# Altium schematic sheet Processor.SchDoc
size A
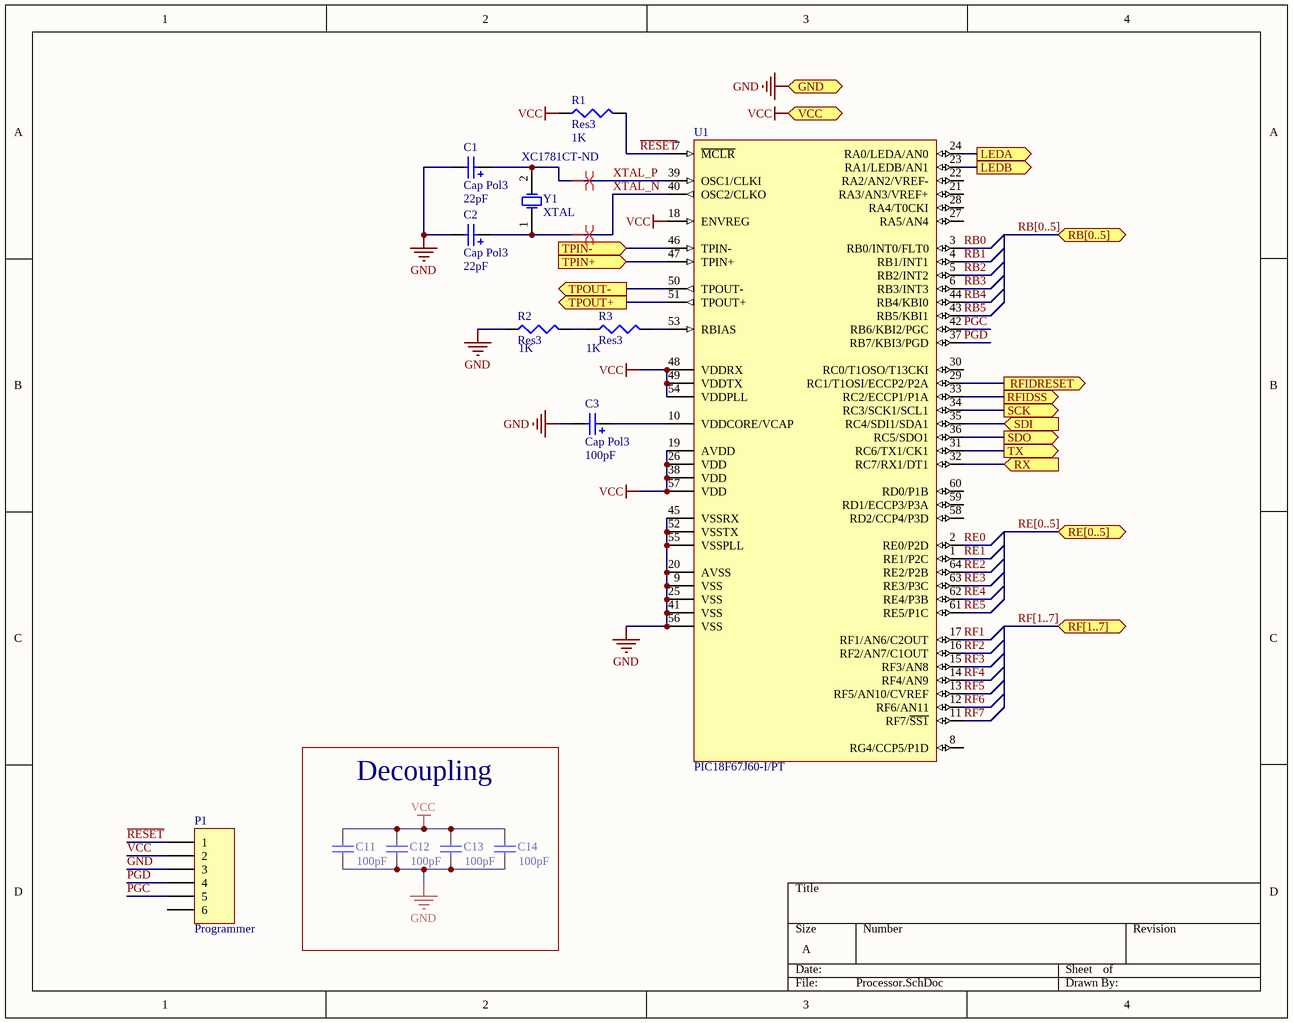
[diagram p0: Processor.SchDoc]

## Parts
C1  Cap Pol3  value 22pF  [C0805]
C2  Cap Pol3  value 22pF  [C0805]
C3  Cap Pol3  value 100pF  [C0805]
C11  value 100pF  [1608[0603]]  (hidden comment: Decoupling)
C12  value 100pF  [1608[0603]]  (hidden comment: Decoupling)
C13  value 100pF  [1608[0603]]  (hidden comment: Decoupling)
C14  value 100pF  [1608[0603]]  (hidden comment: Decoupling)
P1  Programmer  [HDR1X6]
R1  Res3  value 1K  [J1-0603]
R2  Res3  value 1K  [J1-0603]
R3  Res3  value 1K  [J1-0603]
U1  PIC18F67J60-I/PT  [TQFP-PT64_N]
Y1  XTAL  Supplier Part Number 1: XC1781CT-ND  [CSM-3X]

## Blocks framed on the sheet
Decoupling: C11-C14

## Ports
GND, LEDA (out), LEDB (out), RB[0..5] (bidir), RE[0..5] (bidir), RF[1..7] (bidir), RFIDRESET (out), RFIDSS (out), RX (in), SCK (out), SDI (in), SDO (out), TPIN+ (in), TPIN- (in), TPOUT+ (out), TPOUT- (out), TX (out), VCC

## Nets
GND: C1.2 C2.2 C3.2 C11.2 C12.2 C13.2 C14.2 P1.3 R2.1 U1.9(VSS) U1.20(AVSS) U1.25(VSS) U1.41(VSS) U1.45(VSSRX) U1.52(VSSTX) U1.55(VSSPLL) U1.56(VSS) ; port GND
VCC: C11.1 C12.1 C13.1 C14.1 P1.2 R1.1 U1.18(ENVREG) U1.19(AVDD) U1.26(VDD) U1.38(VDD) U1.48(VDDRX) U1.49(VDDTX) U1.54(VDDPLL) U1.57(VDD) ; port VCC
~{RESET}: P1.1 R1.2 U1.7(~{MCLR})
LEDA: U1.24(RA0/LEDA/AN0) ; port LEDA
LEDB: U1.23(RA1/LEDB/AN1) ; port LEDB
PGC: P1.5 U1.42(RB6/KBI2/PGC)
PGD: P1.4 U1.37(RB7/KBI3/PGD)
RB0: U1.3(RB0/INT0/FLT0)
RB1: U1.4(RB1/INT1)
RB2: U1.5(RB2/INT2)
RB3: U1.6(RB3/INT3)
RB4: U1.44(RB4/KBI0)
RB5: U1.43(RB5/KBI1)
RE0: U1.2(RE0/P2D)
RE1: U1.1(RE1/P2C)
RE2: U1.64(RE2/P2B)
RE3: U1.63(RE3/P3C)
RE4: U1.62(RE4/P3B)
RE5: U1.61(RE5/P1C)
RF1: U1.17(RF1/AN6/C2OUT)
RF2: U1.16(RF2/AN7/C1OUT)
RF3: U1.15(RF3/AN8)
RF4: U1.14(RF4/AN9)
RF5: U1.13(RF5/AN10/CVREF)
RF6: U1.12(RF6/AN11)
RF7: U1.11(RF7/~{SS1})
RFIDRESET: U1.29(RC1/T1OSI/ECCP2/P2A) ; port RFIDRESET
RFIDSS: U1.33(RC2/ECCP1/P1A) ; port RFIDSS
RX: U1.32(RC7/RX1/DT1) ; port RX
SCK: U1.34(RC3/SCK1/SCL1) ; port SCK
SDI: U1.35(RC4/SDI1/SDA1) ; port SDI
SDO: U1.36(RC5/SDO1) ; port SDO
TPIN+: U1.47(TPIN+) ; port TPIN+
TPIN-: U1.46(TPIN-) ; port TPIN-
TPOUT+: U1.51(TPOUT+) ; port TPOUT+
TPOUT-: U1.50(TPOUT-) ; port TPOUT-
TX: U1.31(RC6/TX1/CK1) ; port TX
XTAL_N: C2.1 U1.40(OSC2/CLKO) Y1.1(OSC1)
XTAL_P: C1.1 U1.39(OSC1/CLKI) Y1.2(OSC2)
NetC3_1: C3.1 U1.10(VDDCORE/VCAP)
NetR2_2: R2.2 R3.1
NetR3_2: R3.2 U1.53(RBIAS)

Not connected (* = marked no-connect by the designer): P1 6; U1 8(RG4/CCP5/P1D) 21(RA3/AN3/VREF+) 22(RA2/AN2/VREF-) 27(RA5/AN4) 28(RA4/T0CKI) 30(RC0/T1OSO/T13CKI) 58(RD2/CCP4/P3D) 59(RD1/ECCP3/P3A) 60(RD0/P1B)

## Buses and harness runs
bus RB[0..5] = port RB[0..5]
bus RE[0..5] = port RE[0..5]
bus RF[1..7] = port RF[1..7]

## Layout directives
differential pair: XTAL_N, XTAL_P

## Library data of the parts
C1-C3 = Cap Pol3: Polarized Capacitor (Surface Mount); Published: 8-Jun-2000; LatestRevisionDate: 29-May-2009; LatestRevisionNote: IPC-7351 Footprint Added.; PackageReference: C0805; Publisher: Altium Limited; PackageDescription: Chip Capacitor
C11-C14 = Cap Semi: Capacitor (Semiconductor SIM Model); Published: 8-Jun-2000; LatestRevisionDate: 29-May-2009; LatestRevisionNote: IPC-7351 Footprint Added.; PackageReference: C1206; Publisher: Altium Limited; PackageDescription: Chip Capacitor
P1 = Header 6: Header, 6-Pin; LatestRevisionDate: 17-Jul-2002; LatestRevisionNote: Re-released for DXP Platform.; Publisher: Altium Limited
R1-R3 = Res3: Resistor; Published: 8-Jun-2000; LatestRevisionDate: 29-May-2009; LatestRevisionNote: IPC-7351 Footprint Added.; PackageReference: J1-0603; Publisher: Altium Limited; PackageDescription: Chip Resistor
U1 = PIC18F67J60-I/PT: High Performance, 1-Mbit Flash Microcontroller with Ethernet, 128K Flash, 64-Pin TQFP, Industrial Temperature Range; Published: 29-Jan-2009; LatestRevisionDate: 02-Dec-2009; LatestRevisionNote: Updated to datasheet revision E, Oct-2009; DatasheetVersion: revE, Oct-2009; PackageVersion: revBB, Aug-2009; PackageReference: TQFP-PT64; Publisher: Altium Limited; PackageDescription: 64-Lead Thin Plastic Quad Flat Pack (PT) - 10x10x1mm Body, 2.00mm [TQFP]; Supplier 1: Digi-Key; Supplier Part Number 1: PIC18F67J60-I/PT-ND; Supplier 2: Farnell; Supplier Part Number 2: 1332285; Code_JEDEC: MS-026; ComponentLink1Description: Datasheet; ComponentLink1URL: http://ww1.microchip.com/downloads/en/DeviceDoc/39762e.pdf; ComponentLink2Description: Packaging Specification; ComponentLink2URL: http://www.microchip.com/stellent/groups/techpub_sg/documents/packagingspec/en012702.pdf; ComponentLink3Description: Microchip.com Home; ComponentLink3URL: http://www.microchip.com/
Y1 = XTAL: Crystal Oscillator; Published: 8-Jun-2000; LatestRevisionDate: 17-Jul-2002; LatestRevisionNote: Re-released for DXP Platform.; PackageReference: R38; Publisher: Altium Limited; PackageDescription: Crystal, Thru-Hole; 2 Leads; Body 3.1 x 8.2 mm (Dia.xH); Supplier 1: Digi-Key